# EAGLE design fredi-100 (EAGLE 4.16)
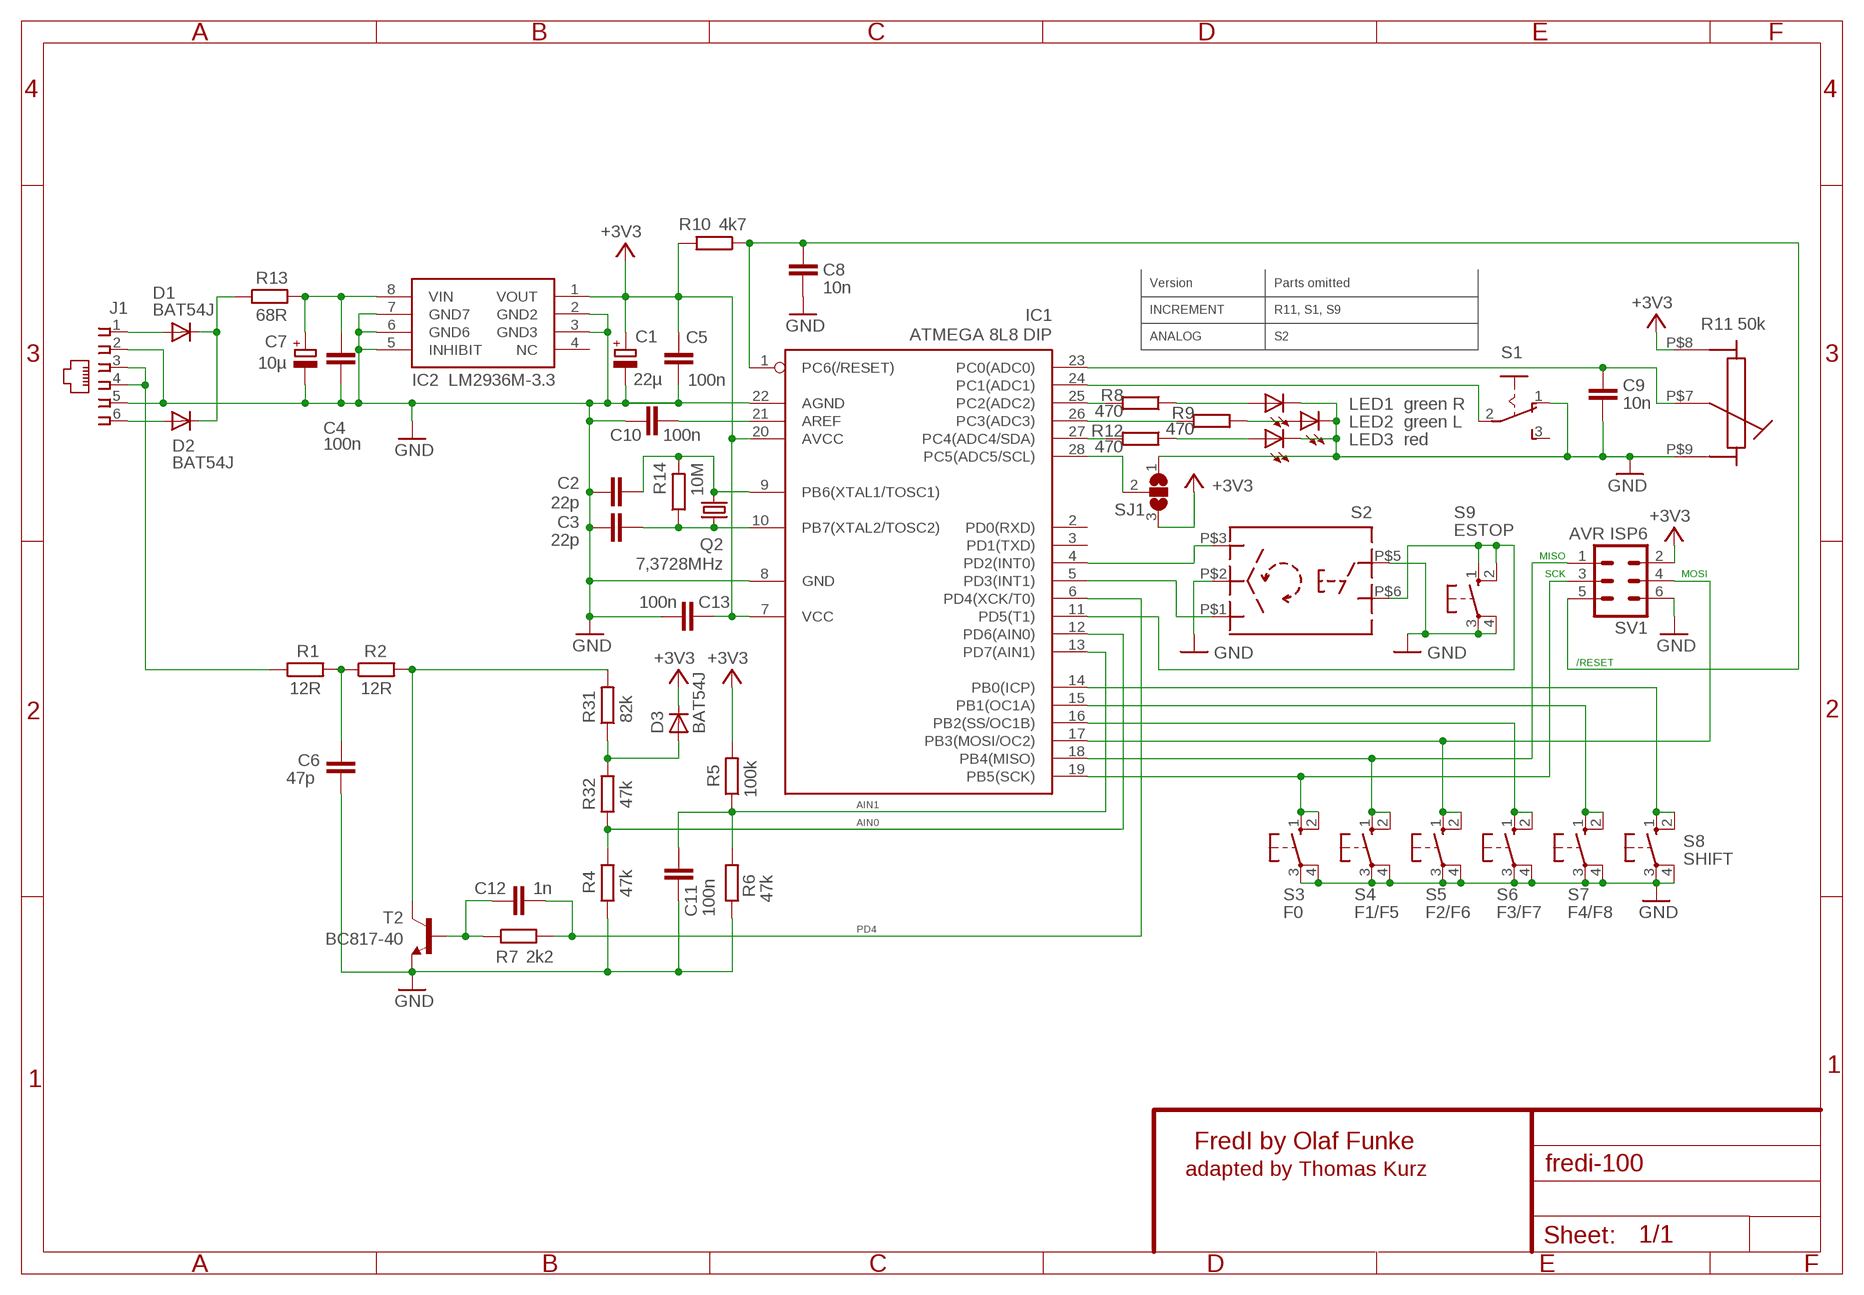
[diagram p0: schematic, sheet 1]

## Parts
C1  22µ  CPOL-EUB  [PANASONIC_B]
C2  22p  C-EUC0805  [C0805]
C3  22p  C-EUC0805  [C0805]
C4  100n  C-EUC0805K  [C0805K]
C5  100n  C-EUC0805  [C0805]
C6  47p  C-EUC0805  [C0805]
C7  10µ  CPOL-EUC  [PANASONIC_C]
C8  10n  C-EUC0805  [C0805]
C9  10n  C-EUC0805  [C0805]
C10  100n  C-EUC0805  [C0805]
C11  100n  C-EUC0805  [C0805]
C12  1n  C-EUC0805  [C0805]
C13  100n  C-EUC0805  [C0805]
D1  BAT54J  DIODE_SOD-323  [SOD2514X100N]
D2  BAT54J  DIODE_SOD-323  [SOD2514X100N]
D3  BAT54J  DIODE_SOD-323  [SOD2514X100N]
IC1  ATMEGA 8L8 DIP  MEGA8-P  [DIL28-3]
IC2  LM2936M-3.3  LE33CD  [SO8]
J1  520425-3  [520425-3]
LED1  green R  LED3MM  [LED3MM]
LED2  green L  LED3MM  [LED3MM]
LED3  red  LED3MM  [LED3MM]
Q2  7,3728MHz  CRYSTALSM49  [SM49]
R1  12R  R-EU_R1206  [R1206]
R2  12R  R-EU_R1206  [R1206]
R4  47k  R-EU_R0805  [R0805]
R5  100k  R-EU_R0805  [R0805]
R6  47k  R-EU_R0805  [R0805]
R7  2k2  R-EU_R0805  [R0805]
R8  470  R-EU_R0805  [R0805]
R9  470  R-EU_R0805  [R0805]
R10  4k7  R-EU_R0805  [R0805]
R12  470  R-EU_R0805  [R0805]
R13  68R  R-EU_R0805  [R0805]
R14  10M  R-EU_R0805  [R0805]
R31  82k  R-EU_R0805  [R0805]
R32  47k  R-EU_R0805  [R0805]
S1  255SB  [255SB]
S2  ENC-POTI  [ENC-POTI]
S3  10-XX  [B3F-10XX]
S4  10-XX  [B3F-10XX]
S5  10-XX  [B3F-10XX]
S6  10-XX  [B3F-10XX]
S7  10-XX  [B3F-10XX]
S8  10-XX  [B3F-10XX]
S9  10-XX  [B3F-10XX]
SJ1  SJ2W  [SJ_2]
SV1  AVR ISP6  ML6  [ML6]
T2  BC817-40  BC850  [SOT23]

## Nets
+3V3: C1.+ C5.1 C13.1 D3.K IC1.7(VCC) IC1.20(AVCC) IC2.1(VOUT) R5.2 R10.2 S2.P$8 SJ1.3 SV1.2
AIN0: IC1.12(PD6(AIN0)) R4.2 R32.1
AIN1: C11.1 IC1.13(PD7(AIN1)) R5.1 R6.2
AREF: C10.2 IC1.21(AREF)
GND: C1.- C2.1 C3.1 C4.2 C5.2 C6.2 C7.- C8.1 C9.1 C10.1 C11.2 C13.2 IC1.8(GND) IC1.22(AGND) IC2.2(GND2) IC2.3(GND3) IC2.5(INHIBIT) IC2.6(GND6) IC2.7(GND7) J1.2 J1.5 LED1.K(C) LED2.K(C) LED3.K(C) R4.1 R6.1 S1.1(O) S2.P$2(B) S2.P$5(P1) S2.P$9 S3.3(P) S3.4(P1) S4.3(P) S4.4(P1) S5.3(P) S5.4(P1) S6.3(P) S6.4(P1) S7.3(P) S7.4(P1) S8.3(P) S8.4(P1) S9.3(P) S9.4(P1) SJ1.1 SV1.6 T2.2(E)
LOCONET: J1.3 J1.4 R1.1
N$1: D1.K D2.K R13.1
N$12: LED1.A R8.1
N$15: D3.A R31.1 R32.2
N$16: C6.1 R1.2 R2.1
N$17: R2.2 R31.2 T2.3(C)
N$20: C12.1 R7.1 T2.1(B)
N$22: LED2.A R9.1
N$25: IC1.26(PC3(ADC3)) R9.2
N$31: LED3.A R12.1
PB0: IC1.14(PB0(ICP)) S8.1(S) S8.2(S1)
PB1: IC1.15(PB1(OC1A)) S7.1(S) S7.2(S1)
PB2: IC1.16(PB2(SS/OC1B)) S6.1(S) S6.2(S1)
PB3: IC1.17(PB3(MOSI/OC2)) S5.1(S) S5.2(S1) SV1.4
PB4: IC1.18(PB4(MISO)) S4.1(S) S4.2(S1) SV1.1
PB5: IC1.19(PB5(SCK)) S3.1(S) S3.2(S1) SV1.3
PC0: C9.2 IC1.23(PC0(ADC0)) S2.P$7
PC1: IC1.24(PC1(ADC1)) S1.2(P)
PC2: IC1.25(PC2(ADC2)) R8.2
PC4: IC1.27(PC4(ADC4/SDA)) R12.2
PC5: IC1.28(PC5(ADC5/SCL)) SJ1.2
PD2: IC1.4(PD2(INT0)) S2.P$3(A)
PD3: IC1.5(PD3(INT1)) S2.P$1(C)
PD4: C12.2 IC1.6(PD4(XCK/T0)) R7.2
PD5: IC1.11(PD5(T1)) S2.P$6(P2) S9.1(S) S9.2(S1)
RESET: C8.2 IC1.1(PC6(/RESET)) R10.1 SV1.5
RS1: D1.A J1.1
RS2: D2.A J1.6
RS_PWR: C4.1 C7.+ IC2.8(VIN) R13.2
XTAL1: C2.2 IC1.9(PB6(XTAL1/TOSC1)) Q2.2 R14.2
XTAL2: C3.2 IC1.10(PB7(XTAL2/TOSC2)) Q2.1 R14.1
Unconnected: IC1.2(PD0(RXD)) IC1.3(PD1(TXD)) IC2.4(NC) S1.3(S)

## Notes on the sheet
- Version | Parts omitted
- INCREMENT | R11, S1, S9
- R11 50k
- ANALOG | S2
- S2
- ESTOP
- MISO
- SCK
- MOSI
- /RESET
- SHIFT
- F0 | F1/F5 | F2/F6 | F3/F7 | F4/F8
- FredI by Olaf Funke
- adapted by Thomas Kurz

## Library data of the parts
C1 C7 = rcl:CPOL-EU: POLARIZED CAPACITOR, European symbol
C2-C6 C8-C13 = rcl:C-EU: CAPACITOR, European symbol
D1-D3 = ipc-7351-diode:DIODE_
IC1 = avr:MEGA8-P: MICROCONTROLLER 8 Kbytes FLASH 1 kbytes SRAM 512 bytes EEPROM USART 4-channel 10 bit ADC 2-channel 8 bit ADC
IC2 = tom:LE33CD
J1 = con-amp:520425-3: AMP connector
LED1-LED3 = led:LED: LED OSRAM: - CHIPLED LG R971, LG N971, LY N971, LG Q971, LY Q971, LO R971, LY R971 LH N974, LH R974 LS Q976, LO Q976, LY Q976 LO Q996 - Hyper CHIPLED LW Q18S LB Q993, LB Q99A, LB R99A - SideLED LS A670, LO A670, LY A670, LG A670, LP A670 LB A673, LV A673, LT A673, LW A673 LH A674 LY A675 LS A676, LA A676, LO A676, LY A676, LW A676 LS A679, LY A679, LG A679 - Hyper Micro SIDELED® LS Y876, LA Y876, LO Y876, LY Y876 LT Y87S - SmartLED LW L88C, LW L88S LB L89C, LB L89S, LG L890 LS L89K, LO L89K, LY L89K LS L896, LA L896, LO L896, LY L896 - TOPLED LS T670, LO T670, LY T670, LG T670, LP T670 LSG T670, LSP T670, LSY T670, LOP T670, LYG T670 LG T671, LOG T671, LSG T671 LB T673, LV T673, LT T673, LW T673 LH T674 LS T676, LA T676, LO T676, LY T676, LB T676, LH T676, LSB T676, LW T676 LB T67C, LV T67C, LT T67C, LS T67K, LO T67K, LY T67K, LW E67C LS E67B, LA E67B, LO E67B, LY E67B, LB E67C, LV E67C, LT E67C LW T67C LS T679, LY T679, LG T679 LS T770, LO T770, LY T770, LG T770, LP T770 LB T773, LV T773, LT T773, LW T773 LH T774 LS E675, LA E675, LY E675, LS T675 LS T776, LA T776, LO T776, LY T776, LB T776 LHGB T686 LT T68C, LB T68C - Hyper Mini TOPLED® LB M676 - Mini TOPLED Santana® LG M470 LS M47K, LO M47K, LY M47K Source: http://www.osram.convergy.de - LUMILED® LXK2-PW12-R00, LXK2-PW12-S00, LXK2-PW14-U00, LXK2-PW14-V00 LXK2-PM12-R00, LXK2-PM12-S00, LXK2-PM14-U00 LXK2-PE12-Q00, LXK2-PE12-R00, LXK2-PE12-S00, LXK2-PE14-T00, LXK2-PE14-U00 LXK2-PB12-K00, LXK2-PB12-L00, LXK2-PB12-M00, LXK2-PB14-N00, LXK2-PB14-P00, LXK2-PB14-Q00 LXK2-PR12-L00, LXK2-PR12-M00, LXK2-PR14-Q00, LXK2-PR14-R00 LXK2-PD12-Q00, LXK2-PD12-R00, LXK2-PD12-S00 LXK2-PH12-R00, LXK2-PH12-S00 LXK2-PL12-P00, LXK2-PL12-Q00, LXK2-PL12-R00 Source: www.luxeon.com
Q2 = crystal:CRYSTAL: CRYSTAL
R1 R2 R4-R10 R12-R14 R31 R32 = rcl:R-EU_: RESISTOR, European symbol
S1 = switch:255SB: SLIDING SWITCH distributor Buerklin, 11G810
S2 = Olaf:ENC-POTI
S3-S9 = switch-omron:10-XX: OMRON SWITCH
SJ1 = jumper:SJ2W: SMD solder JUMPER
SV1 = con-harting-ml:ML6: HARTING
T2 = transistor:BC850: NPN TRANSISTOR

## Board
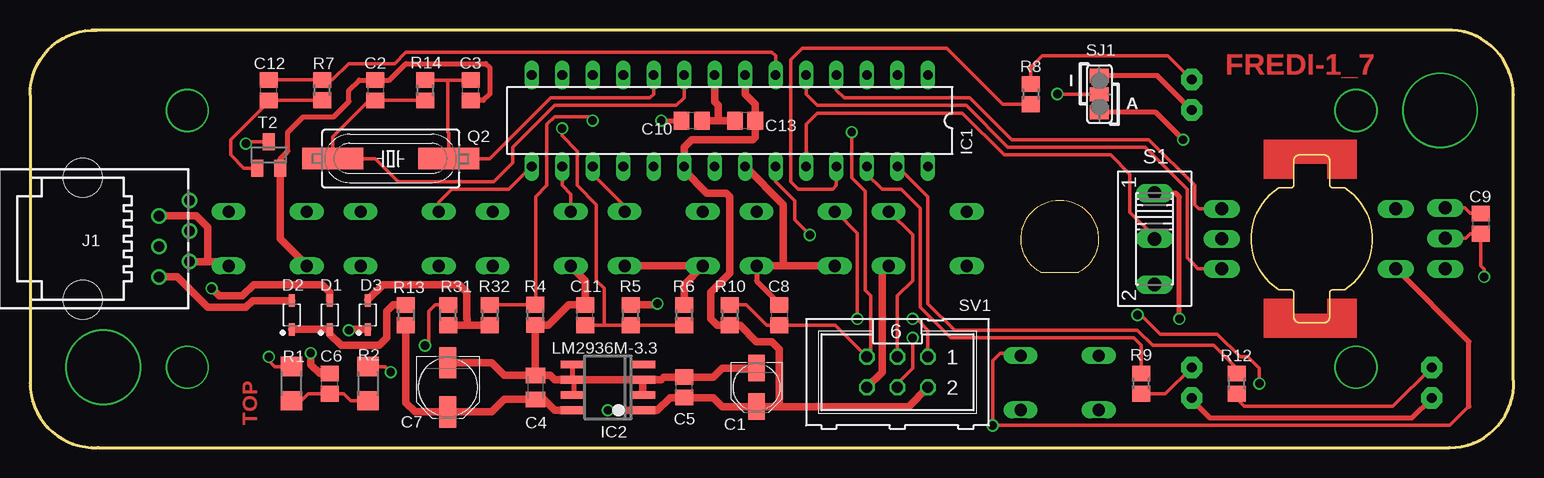
[diagram p1: board, top side]
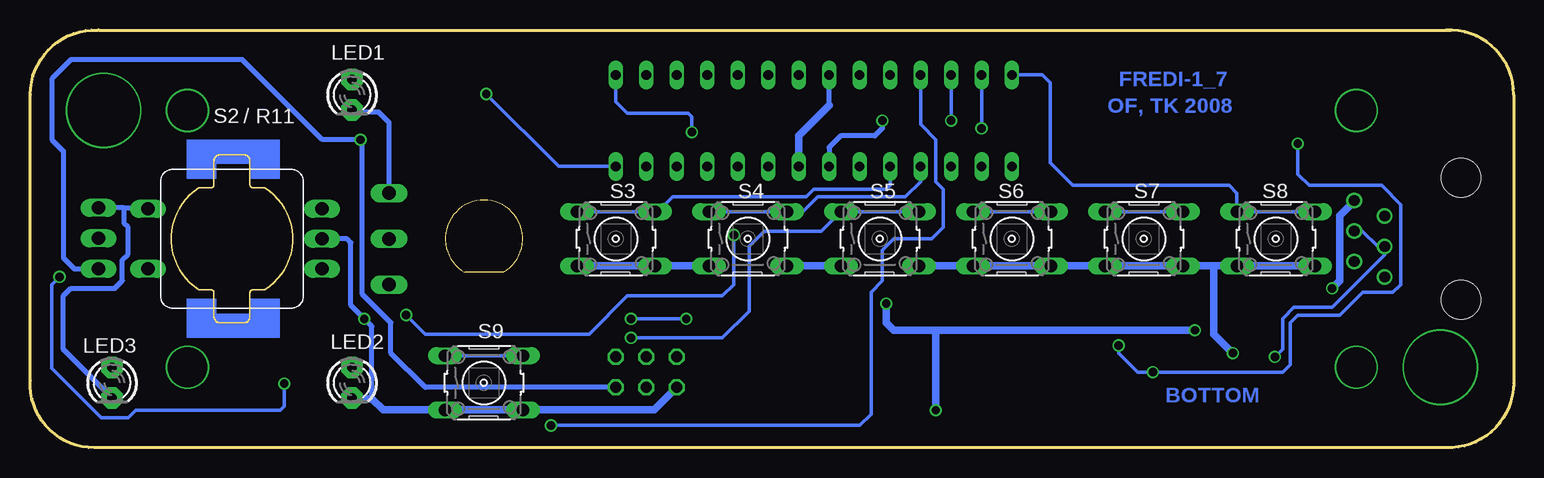
[diagram p2: board, bottom side, seen from below]

Size 123.64 x 34.81 mm. Coordinates in mm from the lower left corner, seen from the top.
Outline: 0,29.44 arc-93 5.62,34.81
Outline: 123.61,29.43 arc93 117.99,34.8
Outline: 118.27,0 arc93 123.64,5.62
Outline: 0.01,5.38 arc93 5.63,0.01
Outline: 117.91,34.81 5.21,34.81
Outline: 5.71,0.01 118.31,0.01
Outline: 123.61,5.61 123.61,29.41
Outline: 0.01,29.41 0.01,5.09
Copper layers (1*16): Top 0.035mm / dielectric 1.5mm / Bottom 0.035mm
Design rules "PCB-POOL": minimum track width 6mil, minimum drill 12mil, track to track 6mil, track to pad 6mil, pad to pad 6mil, via to via 6mil, smd to smd 6mil, copper to edge 20mil, drill to drill 8mil, minimum pad ring 8mil, minimum via ring 6mil, stop-mask expansion 3mil, vias tented up to drill 0mil, thermal gap 8mil
tKeepout: area 101.8,12.4 to 111.8,22.4
bKeepout: area 101.8,12.4 to 111.8,22.4
Milling: 2 lines

### Footprints (pad centres in the part's own frame; a part is rotated, then mirrored left to right if it is on the bottom)
PANASONIC_B = smd 2.2 x 1.4: + 1.6,0; - -1.6,0
C0805 = smd 1.3 x 1.5: 1 -0.85,0; 2 0.85,0
C0805K = smd 1.3 x 1.6: 1 -1,0; 2 1,0
PANASONIC_C = smd 2.6 x 1.4: + 2.05,0; - -2.05,0
SOD2514X100N = smd 1.05 x 0.5: A 1.2,0; K -1.2,0
DIL28-3 = drill 0.813 long: 1 -16.51,-3.81; 2 -13.97,-3.81; 3 -11.43,-3.81; 4 -8.89,-3.81; 5 -6.35,-3.81; 6 -3.81,-3.81; 7 -1.27,-3.81; 8 1.27,-3.81; 9 3.81,-3.81; 10 6.35,-3.81; 11 8.89,-3.81; 12 11.43,-3.81; 13 13.97,-3.81; 14 16.51,-3.81; 15 16.51,3.81; 16 13.97,3.81; 17 11.43,3.81; 18 8.89,3.81; 19 6.35,3.81; 20 3.81,3.81; 21 1.27,3.81; 22 -1.27,3.81; 23 -3.81,3.81; 24 -6.35,3.81; 25 -8.89,3.81; 26 -11.43,3.81; 27 -13.97,3.81; 28 -16.51,3.81
SO8 = smd 0.635 x 2.032: 1 -1.905,-2.921; 2 -0.635,-2.921; 3 0.635,-2.921; 4 1.905,-2.921; 5 1.905,2.921; 6 0.635,2.921; 7 -0.635,2.921; 8 -1.905,2.921
520425-3 = drill 0.889 round: 1 -3.175,8.001; 2 -1.905,5.461; 3 -0.635,8.001; 4 0.635,5.461; 5 1.905,8.001; 6 3.175,5.461 | hole 3.251: -5.08,-0.889; 5.08,-0.889
LED3MM = drill 0.813 pad 1.778 octagon: A -1.27,0; K 1.27,0
SM49 = smd 5.08 x 1.778: 1 -4.826,0; 2 4.826,0
R1206 = smd 1.6 x 1.803: 1 -1.422,0; 2 1.422,0
R0805 = smd 1.3 x 1.5: 1 -0.85,0; 2 0.85,0
255SB = drill 1.118 long: 1 -3.81,0; 2 0,0; 3 3.81,0
ENC-POTI = drill 1.1 long: P$1 -7.5,2.5; P$2 -7.5,0; P$3 -7.5,-2.5; P$5 7,-2.5; P$6 7,2.5; P$7 11.127,-0.04; P$8 11.127,2.5; P$9 11.127,-2.58
B3F-10XX = drill 1.016 long: 1 -3.251,2.261; 2 3.251,2.261; 3 -3.251,-2.261; 4 3.251,-2.261
SJ_2 = smd 1.168 x 1.6: 1 -1.524,0; 2 0,0; 3 1.524,0
ML6 = drill 0.914 octagon: 1 -2.54,-1.27; 2 -2.54,1.27; 3 0,-1.27; 4 0,1.27; 5 2.54,-1.27; 6 2.54,1.27
SOT23 = smd 1 x 1.4: 1 -0.95,-1.1; 2 0.95,-1.1; 3 0,1.1

### Placement (x,y rotation side)
C1  60.54,5.03 270 top
C2  28.79,29.79 270 top
C3  36.73,29.79 90 top
C4  42.12,5.03 90 top
C5  54.51,5.03 90 top
C6  24.98,5.35 90 top
C7  34.82,5.03 270 top
C8  62.45,11.06 270 top
C9  120.88,18.68 270 top
C10  55.14,27.25 180 top
C11  46.25,11.06 90 top
C12  19.9,29.79 90 top
C13  59.59,27.25 180 top
D1  24.98,11.06 90 top
D2  21.8,11.06 90 top
D3  28.16,11.06 90 top
IC1  58.32,27.25 180 top
IC2  48.16,5.03 90 top
J1  5.29,17.41 270 top
LED1  96.81,29.41 270 bottom
LED2  96.81,5.41 270 bottom
LED3  116.81,5.41 270 bottom
Q2  30.06,24.09 180 top
R1  21.8,5.35 270 top
R2  28.16,5.35 90 top
R4  42.12,11.06 90 top
R5  50.06,11.06 90 top
R6  54.51,11.06 270 top
R7  24.35,29.8 90 top
R8  83.4,29.48 270 top
R9  92.61,5.35 90 top
R10  58.32,11.06 270 top
R12  100.55,5.35 90 top
R13  31.33,11.06 270 top
R14  32.92,29.79 270 top
R31  34.84,11.06 90 top
R32  38.31,11.06 270 top
S1  93.72,17.41 270 top
S2  106.81,17.41 180 bottom
S3  74.81,17.41 0 bottom
S4  63.81,17.41 0 bottom
S5  52.81,17.41 0 bottom
S6  41.81,17.41 0 bottom
S7  30.81,17.41 0 bottom
S8  19.81,17.41 0 bottom
S9  85.81,5.41 0 bottom
SJ1  89.12,29.48 270 top
SV1  72.29,6.3 180 top
T2  19.9,24.39 0 top

### Tracks (layer width: path | path; a pad name or v marks a point on that pad's centre or on a via)
+3V3  (via drill 0.7)
  Top 0.305: IC1.7 59.57,31.08 | v52.29,12.01 52.07,11.91
  Top 0.406: SJ1.3 93.81,27.95 v96.1,25.66 | v26.57,9.79 26.64,9.86
  Top 0.61: v48.16,3.12 IC2.1 52.29,3.12 53.34,4.18 C5.1 56.95,4.18 57.7,3.43 C1.+ 62.45,3.43 | 62.45,3.43 73.23,3.43 SV1.2 | 52.07,11.91 R5.2 | 62.45,3.43 62.45,8.2 61.81,8.84 60.54,8.84 59.17,10.21 R10.2 57.26,10.21 56.73,10.74 56.73,12.96 58.32,14.55 58.32,20.9 58,21.22 56.41,21.22 54.51,23.12 IC1.20 54.51,25.03 55.14,25.66 60.22,25.66 60.44,25.88 C13.1 60.44,28.62 59.59,29.48 IC1.7 | 26.64,9.86 D3.K
  Bottom 0.406: SV1.2 90.7,5.03 93.56,7.88 93.56,10.43 95.94,12.81 95.94,25.51 v96.1,25.66 99.28,25.66 105.94,32.33 120.23,32.33 121.82,30.75 121.82,25.66 120.87,24.71 120.87,15.82 119.95,14.91 S2.P$8
  Bottom 0.61: 48.16,9.79 51.65,9.79 52.29,10.43 v52.29,12.01 | 48.16,9.79 v26.57,9.79 | v48.16,3.12 48.16,9.79
AIN0  (via drill 0.7)
  Top 0.305: v46.89,27.25 46.57,27.57 43.71,27.57 43.08,26.94 43.08,21.86 42.12,20.9 42.12,12.01 42.12,12 R4.2 41.91,11.91 41.81,12.01 41.7,11.91 R32.1
  Bottom 0.305: IC1.12 v46.89,27.25
AIN1  (via drill 0.7)
  Top 0.305: v44.35,26.62 44.35,25.98 45.62,24.71 45.62,21.86 47.2,20.27 47.2,13.92 47.84,13.28 47.84,10.21 | 47.84,10.21 49.96,10.21 50.06,10.11 R5.1 54.41,10.21 54.51,10.11 R6.2 | 47.84,10.21 C11.1
  Bottom 0.305: IC1.13 v44.35,26.62
AREF  (via drill 0.7)
  Top 0.406: v52.6,27.25 C10.2
  Bottom 0.406: v52.6,27.25 52.6,26.62 53.24,25.98 56.09,25.98 57.05,25.03 IC1.21
GND  (via drill 0.7)
  Top 0.305: 71.37,15.15 71.34,15.19 | LED1.K | LED3.K | 96.73,4.07 LED2.K | T2.2 20.85,23.44 | C4.2 42.12,6.3 42.12,6.31 | 44.98,15.19 45.02,15.15 S6.3 | 23.08,15.19 23.06,15.17 S8.3 | C9.1 120.02,19.53 119.56,19.99 S2.P$9
  Top 0.406: IC2.5 45.24,5.73 45.3,5.66 | IC2.7 45.3,4.39 45.3,5.66 | 51.08,5.6 51.02,5.66 IC2.3 | IC2.6 45.3,5.66 | S8.4 16.45,15.15 | 14.82,15.51 | S4.4 60.56,13.94 60.54,13.92 62.45,12.01 C8.1 | S3.4 71.37,15.15 | LED1.K 94.19,30.75 | 94.19,30.75 94.04,30.9 | S1.1 95.47,21.22 95.78,20.9 v95.78,10.74 | LED3.K 115.15,2.49 98.32,2.49 96.73,4.07 | SJ1.1 93.94,31 94.19,30.75 | 20.85,23.44 20.85,24.08 21.49,24.71 21.49,26.3 22.76,27.57 25.3,27.57 26.57,28.84 26.57,29.79 27.42,30.64 C2.1 29.96,30.64 31.33,32.02 38,32.02 38.31,31.7 38.31,29.48 37.78,28.94 C3.1 | 52.6,5.66 52.82,5.88 | 56.09,15.19 S5.3
  Top 0.61: S4.4 62.76,15.15 | 62.76,15.15 S4.3 | 51.08,5.6 IC2.2 | 45.3,5.66 51.02,5.66 52.6,5.66 | 14.82,15.51 16.09,15.51 16.45,15.15 | 14.82,15.51 J1.5 | J1.2 13.86,19.32 14.82,18.36 14.82,15.51 | SV1.6 71.02,6.3 71.02,14.87 71.34,15.19 | IC1.22 62.76,20.27 62.76,15.15 | v23.39,7.88 23.39,6.93 24.13,6.2 C6.2 | C7.- 38.49,7.08 39.54,6.03 C4.2 43.35,6.03 43.71,5.66 IC2.6 | 52.82,5.88 C5.2 56.95,5.88 57.7,6.63 C1.- | 42.12,6.31 R4.1 43.19,10.21 44.88,11.91 C11.2 46.25,13.92 45.02,15.15 | R6.1 54.51,13.6 S5.3 | T2.2 20.85,17.41 23.08,15.19 | 57.37,27.25 C10.1 | 57.37,27.25 C13.2 | 57.37,27.25 57.37,28.52 57.05,28.84 IC1.8 | S5.3 55.82,15.15 55.78,15.19 55.74,15.15 S5.4
  Bottom 0.305: IC1.8 57.03,31.08 | 23.06,15.17 23.04,15.15 | S7.3 34.15,15.15 34.19,15.19 34.23,15.15 | S7.4 27.52,15.19 | 23.06,15.17 23.08,15.19 23.11,15.15 | 23.06,15.17 S8.3 | S6.3 45.02,15.15 44.98,15.19 44.94,15.15 | S4.4 60.56,15.17 60.54,15.19 60.5,15.15 | S4.3 67.17,15.15 67.21,15.19 | S3.4 71.61,15.15 71.65,15.19 | S3.3 78.04,15.15 78,15.19 77.96,15.15 | S9.4 82.47,3.15 82.45,3.12 | 96.73,4.07 LED2.K | S9.3 89.09,3.15 | 24.98,15.15 24.98,15.19
  Bottom 0.406: 57.05,28.52 IC1.8 | S1.1 93.72,27.09 94.59,27.96 96.81,27.96 LED1.K | 95.15,4.07 95.15,10.11 v95.78,10.74 96.89,11.85 96.89,17.09 97.21,17.41 S2.P$2 | LED3.K 120.87,8.2 120.87,12.65 120.23,13.28 116.58,13.28 115.94,13.92 115.94,15.66 115.47,16.14 115.47,18.36 115.78,18.68 115.78,19.99 | S2.P$5 113.84,19.91 113.92,19.99 115.78,19.99 | 115.78,19.99 S2.P$9
  Bottom 0.61: IC1.22 59.57,26 57.05,28.52 | 23.04,15.15 S8.4 | 34.23,15.15 S6.4 44.94,15.15 | S7.3 S7.4 24.98,15.15 | 24.98,15.15 23.11,15.15 | S5.4 S6.3 | 60.5,15.15 S5.3 | S4.3 S3.4 77.96,15.15 | S9.3 S9.4 71.63,3.15 SV1.6 | 96.73,4.07 95.15,4.07 94.22,3.15 89.09,3.15 | 24.98,15.15 24.98,9.47 v23.39,7.88
LOCONET  (via drill 0.7)
  Top 0.305: v19.9,7.57 19.9,7.25 20.22,6.93 20.32,6.83 20.38,6.77 R1.1
  Bottom 0.305: J1.3 12.6,18.05 11.33,16.78 J1.4 10.75,16.09 15.14,11.7 18.31,11.7 19.27,10.74 19.27,8.2 v19.9,7.57
N$1
  Top 0.406: D1.K 24.98,9.79 24.91,9.86
  Top 0.61: 24.91,9.86 D2.K | D1.K 24.98,9.47 25.93,8.52 29.11,8.52 29.74,9.15 29.74,11.38 30.28,11.91 R13.1
N$12
  Top 0.305: R8.1 83.4,31.7 84.35,32.65 94.83,32.65 LED1.A
N$15
  Top 0.406: 28.16,12.33 D3.A | R32.2 38.31,10.11 38.21,10.21 | 36.42,10.73 36.41,10.74
  Top 0.61: 28.16,12.33 29.43,13.6 35.78,13.6 36.41,12.96 36.41,10.74 | 38.21,10.21 36.42,10.21 | 36.42,10.21 R31.1 | 36.42,10.21 36.42,10.73
N$16
  Top 0.305: R1.2 22.61,3.92 23.18,4.5 24.88,4.5 24.98,4.39 C6.1 26.15,4.5 26.72,3.92 R2.1
N$17  (via drill 0.7)
  Top 0.305: v32.92,8.52 33.23,8.84 33.23,11.38 33.77,11.91 R31.2 | T2.3 18.14,25.5 v18,25.35 | R2.2 29.59,6.77 v30.06,6.3
  Bottom 0.305: v32.92,8.52 32.92,7.88 31.33,6.3 v30.06,6.3 19.27,6.3 18.63,6.93 18.63,10.43 18,11.06 14.5,11.06 12.6,12.96 10.06,12.96 9.42,13.6 9.42,20.27 11.01,21.86 17.04,21.86 18,22.81 v18,25.35
N$20
  Top 0.305: T2.1 17.83,23.3 16.73,24.39 16.73,25.66 19.9,28.84 C12.1 24.13,28.94 24.34,29.16 24.35,29.15 R7.1
N$22
  Top 0.305: LED2.A 94.62,4.5 R9.1
N$25
  Top 0.305: IC1.26 69.75,22.81 71.02,21.54 72.61,21.54 74.19,19.95 74.19,11.7 76.73,9.15 91.97,9.15 92.61,8.52 R9.2
N$31
  Top 0.305: LED3.A 113.56,3.44 101.18,3.44 100.55,4.07 R12.1
N$34  (via drill 6 pad 6)
  other vias: 117.51,28.11
N$35  (via drill 3.3)
  other vias: 110.51,28.11
N$36  (via drill 3.3)
  other vias: 110.51,6.71
N$37  (via drill 3.3)
  other vias: 13.11,6.71
N$38  (via drill 3.3)
  other vias: 13.11,28.11
N$41  (via drill 6 pad 6)
  other vias: 6.11,6.71
PB0
  Bottom 0.305: 23.06,19.65 23.08,19.63 | 23.06,19.65 S8.1 23.06,21.21 23.71,21.86 36.73,21.86 38.63,23.76 38.63,30.43 39.27,31.06 IC1.14 | S8.2 23.04,19.67 23.06,19.65
PB1
  Top 0.305: S7.1 34.06,20.46 35.14,21.54 39.9,21.54 IC1.15
  Bottom 0.305: S7.1 34.15,19.67 | 34.15,19.67 S7.2 | 34.15,19.67 34.19,19.63
PB2
  Top 0.305: S6.1 45.06,21.14 44.35,21.86 IC1.16
  Bottom 0.305: S6.1 45.02,19.67 44.98,19.63 44.94,19.67 S6.2
PB3  (via drill 0.7)
  Top 0.305: S5.2 49.56,20.14 46.89,22.81 IC1.17 | SV1.4 72.29,5.35 73.56,6.62 v73.56,9.15
  Bottom 0.305: S5.2 S5.1 | v73.56,9.15 65.94,9.15 63.72,11.38 63.72,16.77 62.45,18.05 57.68,18.05 S5.1 | S5.1
PB4  (via drill 0.7)
  Top 0.305: v73.56,10.74 73.88,10.74 74.83,9.79 SV1.1 | S4.1 67.17,19.67 68.95,17.89 v68.95,10.74
  Bottom 0.305: IC1.18 49.43,22.17 50.7,20.9 58,20.9 59.23,19.67 S4.2 60.56,19.65 | v68.95,10.74 v73.56,10.74 | S4.1 66.93,19.67 66.89,19.63 66.87,19.65 60.56,19.65 | 60.56,19.65 60.54,19.63
PB5
  Top 0.305: SV1.3 72.29,12.65 73.56,13.92 73.56,17.73 71.61,19.67 S3.2
  Bottom 0.305: S3.1 78.04,19.67 78,19.63 77.96,19.67 S3.2 71.3,19.67 70.06,20.9 58.95,20.9 58.32,21.54 52.29,21.54 51.97,21.86 IC1.19
PC0  (via drill 0.7)
  Top 0.305: S2.P$7 119.64,17.45 120.02,17.83 C9.2 120.88,15.17 121.18,14.87 v121.18,14.23 | IC1.23 62.13,22.17 63.72,20.59 63.72,19 v64.98,17.73 | v92.29,11.06 92.61,11.06 94.19,9.47 98.96,9.47 100.86,7.57 101.5,7.57 102.45,6.62 v102.45,5.35
  Bottom 0.305: v64.98,17.73 64.98,13.6 65.94,12.65 73.88,12.65 77.05,9.47 90.7,9.47 v92.29,11.06 | v102.45,5.35 102.45,3.44 102.77,3.12 114.83,3.12 115.47,2.49 117.69,2.49 121.82,6.62 121.82,13.6 v121.18,14.23
PC1
  Top 0.305: S1.2 93.56,17.41 93.72,17.57 91.66,19.63 91.66,22.81 90.07,24.39 81.18,24.39 77.69,27.89 65.62,27.89 64.67,26.94 IC1.24
PC2
  Top 0.305: R8.2 81.08,28.62 76.42,33.28 64.35,33.28 63.4,32.33 63.4,22.17 64.03,21.54 66.89,21.54 67.21,21.86 IC1.25
PC4
  Top 0.305: IC1.27 74.83,20.9 74.83,12.01 77.05,9.79 92.29,9.79 93.56,8.52 98.64,8.52 100.55,6.62 R12.2
PC5  (via drill 0.7)
  Top 0.305: v85.62,29.48 SJ1.2
  Bottom 0.305: v85.62,29.48 79.59,23.44 IC1.28
PD2
  Top 0.305: IC1.4 67.21,29.79 67.84,29.16 78.32,29.16 81.81,25.66 93.24,25.66 97.05,21.86 97.05,20.27 97.37,19.95 97.41,19.91 S2.P$3
PD3
  Top 0.305: IC1.5 64.67,29.48 65.62,28.52 78,28.52 81.5,25.03 92.92,25.03 96.42,21.54 96.42,15.82 97.05,15.19 97.33,14.91 S2.P$1
PD4
  Top 0.305: IC1.6 62.11,31.36 62.13,31.38 62.13,32.65 61.81,32.97 31.33,32.97 30.38,32.02 26.57,32.02 25.2,30.65 R7.2 20.12,30.65 19.9,30.43 C12.2
PD5  (via drill 0.7)
  Top 0.305: 119.91,3.44 118.33,1.85 v80.22,1.85 80.22,7.25 80.86,7.88 82.13,7.88 82.45,7.57 S9.2
  Top 0.406: S2.P$6 113.84,14.91 119.91,8.84 119.91,3.44
  Bottom 0.305: 89.22,7.67 S9.1 | 89.22,7.67 S9.2 82.66,7.67 82.77,7.57 | 89.22,7.67 89.43,7.88 | v80.22,1.85 54.51,1.85 53.55,2.8 53.55,12.96 52.6,13.92 52.6,16.46 51.65,17.41 48.48,17.41 47.52,18.36 47.52,21.54 48.16,22.17 48.16,25.66 49.43,26.94 IC1.11
RESET  (via drill 0.7)
  Top 0.305: v68.48,26.3 68.48,22.49 69.43,21.54 69.59,21.38 69.59,13.12 70.06,12.65 70.06,7.88 SV1.5 67.11,10.21 C8.2 61.39,10.21 59.69,11.91 R10.1
  Bottom 0.305: IC1.1 74.83,28.84 73.88,27.89 68.8,27.89 68.48,27.57 v68.48,26.3
RS1  (via drill 0.7)
  Top 0.61: v15.14,13.28 15.77,12.65 17.68,12.65 18.63,13.6 24.34,13.6 24.98,12.96 D1.A
  Bottom 0.406: 13.23,20.59 J1.1
  Bottom 0.61: v15.14,13.28 14.5,13.92 14.5,19.32 13.23,20.59
RS2
  Top 0.406: 11.01,14.23 11.01,14.24
  Top 0.61: D2.A 18.56,12.26 18,11.7 14.82,11.7 12.28,14.23 11.01,14.23 | 11.01,14.24 J1.6
RS_PWR
  Top 0.61: R13.2 31.33,3.76 32.11,2.98 C7.+ 38.49,2.98 39.54,4.03 C4.1 42.81,4.03 43.71,3.12 IC2.8
XTAL1
  Top 0.305: 54.49,31.08 IC1.9 54.51,29.16 53.87,28.52 43.71,28.52 40.22,25.03 40.22,23.76 38.63,22.17 30.7,22.17 28.78,24.09 Q2.2 25.23,25.92 28.26,28.94 C2.2 32.81,28.94 32.92,28.84 R14.2
XTAL2
  Top 0.305: 51.95,31.08 IC1.10 51.97,29.48 51.65,29.16 43.4,29.16 38.33,24.09 Q2.1 34.89,26.24 34.82,26.3 34.82,30.64 | C3.2 36.73,30.75 36.62,30.64 34.82,30.64 | 34.82,30.64 R14.1

### Text on the board
Top: FREDI-1_7 | TOP
Bottom: FREDI-1_7 | OF, TK 2008 | BOTTOM
tPlace: I | A
bPlace: / R11
PRINT_TOP: C12 | R7 | C2 | R14 | C3 | 1 | R8 | SJ1 | I | A | C10 | C13 | ATMEGA8L | J1 | IC1 | S1 | C9 | T2 | Q2 | D2 | D1 | D3 | R13 | R31 | R32 | R4 | C11 | R5 | R6 | R10 | C8 | AVR ISP6 | 1 | R9 | R12 | + | R1 | C6 | R2 | C7 | + | C4 | 1 | C5 | C1 | IC2
PRINT_BOTTOM: LED1 green R | + | S2 | / R11 | F4/F8 | SHIFT | F3/F7 | F2/F6 | F1/F5 | F0 | ESTOP | FredI by O. Funke | LED2 green L | LED3 red | Layout by T. Kurz | Fredi-1_7, 2008 | + | +